# Altium schematic sheet Top.SchDoc
size A3
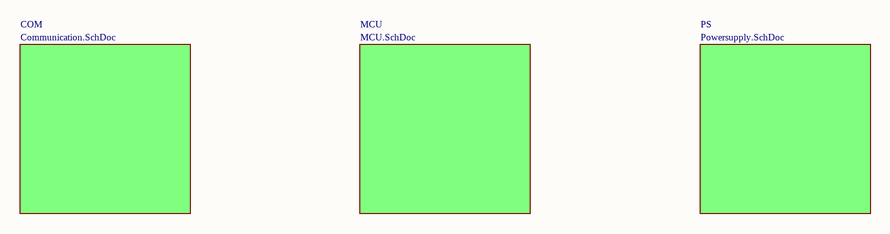
[diagram p0: Top.SchDoc]

## Sub-sheets
COM = Communication.SchDoc: no entries
MCU = MCU.SchDoc: no entries
PS = Powersupply.SchDoc: no entries